# Altium project SistemaMonitoreo.PrjPcb
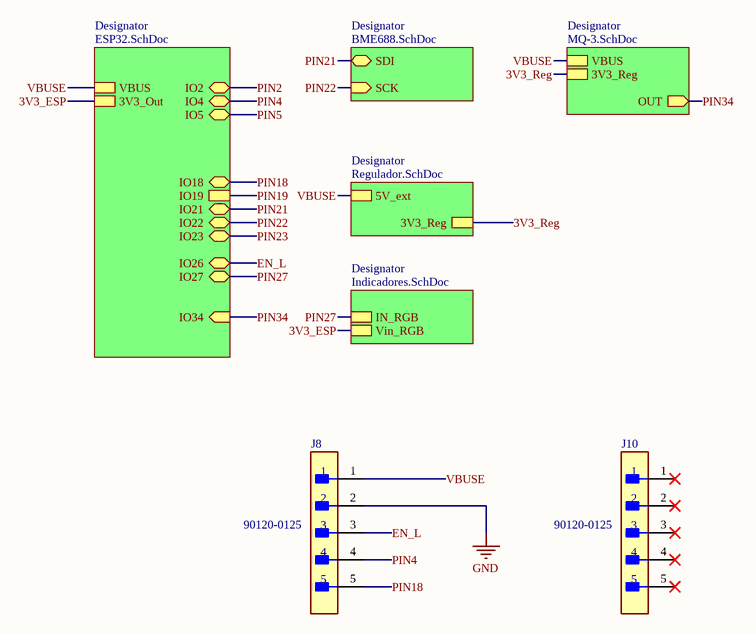
[diagram p0: Main.SchDoc]
6 sheets, 45 parts. Net scope: hierarchical (ports join the sheet entries above them; power ports are global).
Board file: SistemaMonitoreo.PcbDoc
Sheets:
  Main.SchDoc
    Designator = ESP32.SchDoc
    Designator = MQ-3.SchDoc
    Designator = Regulador.SchDoc
    Designator = BME688.SchDoc
    Designator = Indicadores.SchDoc

## Sheet Main.SchDoc
size A4; SheetNumber: 1; SheetTotal: 6

### Parts
J8  90120-0125  [FP-90120-0125-MFG]
J10  90120-0125  [FP-90120-0125-MFG]

### Sub-sheets
Designator = ESP32.SchDoc: IO18 (bidir), IO21 (bidir), IO22 (bidir), IO23 (bidir), IO27 (bidir), IO34 (in), VBUS, 3V3_Out, IO2 (bidir), IO4 (bidir), IO5 (bidir), IO19, IO26 (bidir)
Designator = MQ-3.SchDoc: OUT (out), 3V3_Reg, VBUS
Designator = Regulador.SchDoc: 3V3_Reg, 5V_ext
Designator = BME688.SchDoc: SDI (bidir), SCK (in)
Designator = Indicadores.SchDoc: IN_RGB, Vin_RGB

### Nets
3V3_ESP: sheet Designator/3V3_Out, sheet Designator/Vin_RGB  [project net 3V3]
GND: J8.2
VBUSE: J8.1 ; sheet Designator/VBUS, sheet Designator/VBUS, sheet Designator/5V_ext  [project net VBUS]
3V3_Reg: sheet Designator/3V3_Reg, sheet Designator/3V3_Reg
EN_L: J8.3 ; sheet Designator/IO26
PIN4: J8.4 ; sheet Designator/IO4  [project net IO4]
PIN18: J8.5 ; sheet Designator/IO18  [project net IO18]
PIN21: sheet Designator/IO21, sheet Designator/SDI  [project net IO21]
PIN22: sheet Designator/IO22, sheet Designator/SCK  [project net IO22]
PIN27: sheet Designator/IO27, sheet Designator/IN_RGB  [project net IO27]
PIN34: sheet Designator/IO34, sheet Designator/OUT  [project net IO34]

Not connected (* = marked no-connect by the designer): J10 1* 2* 3* 4* 5*

### Library data of the parts
J8 J10 = CMP-00257-00655425-1: 90120-0125 2.54mm Pitch C-Grid III Header, Single Row, Vertical, 5 Circuits, Tin (Sn) Plating; NexarPartId: 655425; Manufacturer Lifecycle Status: ACTIVE; Lead Length: 2.9mm; Number of Positions: 5; Current Rating: 3A; Mating Post Length: 6.75mm; Glow Wire Compliant: Non-compliant; Contact Resistance: 20mΩ; Voltage Rating: 350V; Gender: Male; Max Voltage Rating (DC): 350.35kV; Max Operating Temperature: 125°C; Number of Pins: 5; Plating: Tin; Contact Material: Brass; Mount: Through Hole; Contact Gender: Male; Packaging: Bulk; Schedule B: 8536694040; Lifecycle Status: Production; Lead Pitch: 2.54mm; Radiation Hardening: No; Orientation: Vertical; Min Operating Temperature: -55°C; Country of Origin: SK; Housing Color: Black; REACH SVHC: No SVHC; Contact Plating: Tin; Number of Rows: 1; Number of Circuits: 5; Termination: Solder; Number of Contacts: 5; Pitch: 2.54mm; Housing Material: Polyester; RoHS: Compliant; Lead Free: Lead Free; Voltage Rating (AC): 350V

## Sheet ESP32.SchDoc
size A4; SheetNumber: 2; SheetTotal: 6
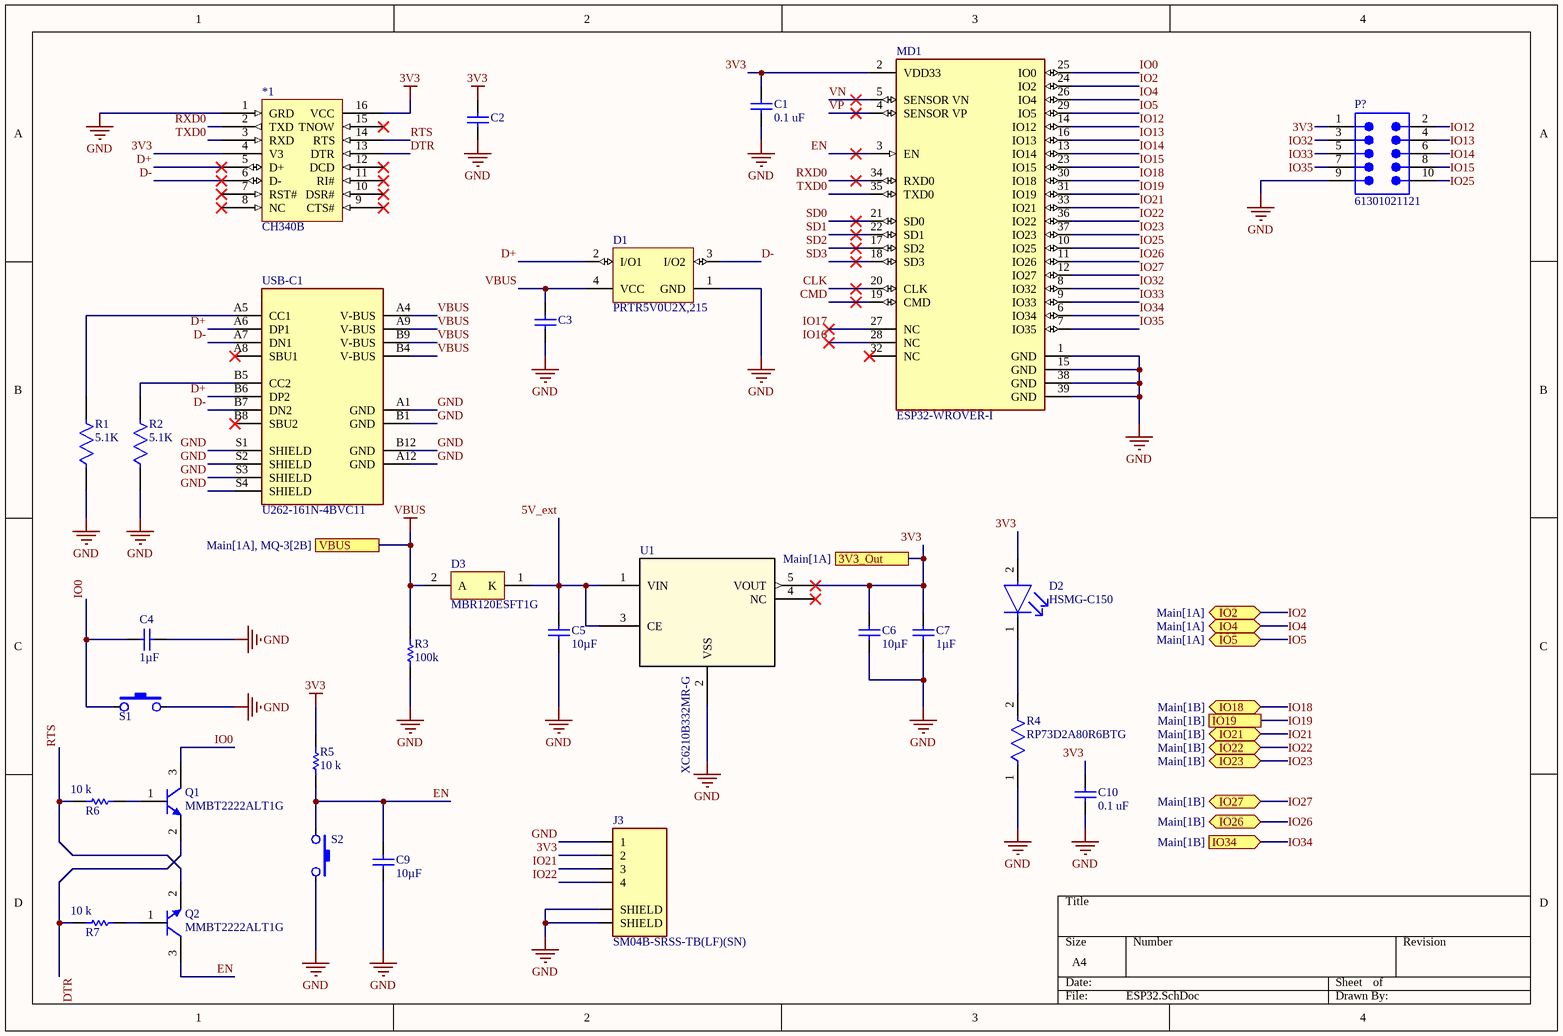
[diagram p1: ESP32.SchDoc]

### Parts
*1  CH340B  [CH340B]
C1  0.1 uF  [CAPC2013X94X50ML20T25]
C2  08055C104KAT2A  [CAPC2013X94X50ML20T25]  (value not drawn)
C3  08055C104KAT2A  [CAPC2013X94X50ML20T25]  (value not drawn)
C4  1µF  [CAPC2013X145X50ML20T25]
C5  10µF  [CAPC2013X140X50ML20T25]
C6  10µF  [CAPC2013X140X50ML20T25]
C7  1µF  [CAPC2013X145X50ML20T25]
C9  10µF  [CAPC2013X145X50ML20T25]
C10  0.1 uF  [CAPC2013X94X50ML20T25]
D1  PRTR5V0U2X,215  [NXP-SOT143B-4_V]
D2  HSMG-C150  [FP-HSMG-C150-MFG]
D3  MBR120ESFT1G  [ONSC-SOD-123FL-2-498_V]
J3  SM04B-SRSS-TB(LF)(SN)  [JST_SM04B-SRSS-TB(LF)(SN)]
MD1  ESP32-WROVER-I  [FP-ESP32-WROVER-I-MFG]
P?  61301021121  [61301021121]
Q1  MMBT2222ALT1G  [ONSC-SOT-23-3-318-08_V]
Q2  MMBT2222ALT1G  [ONSC-SOT-23-3-318-08_V]
R1  5.1K  [FP-CRCW0805-e3-MFG]
R2  5.1K  [FP-CRCW0805-e3-MFG]
R3  100k  [RESC2013X60X40ML20T25]
R4  RP73D2A80R6BTG  [FP-RP732A-MFG]
R5  10 k  [RESC2013X60X30ML20T20]
R6  10 k  [RESC2013X60X30ML20T20]
R7  10 k  [RESC2013X60X30ML20T20]
S1  IO0  [SMT_SW_PTS_820]  (value not drawn)
S2  PTS820J25MSMTRLFS  [SMT_SW_PTS_820]  (value not drawn)
U1  XC6210B332MR-G  [SOT-25_TOR-M]
USB-C1  U262-161N-4BVC11  [U262-161N-4BVC11]

### Ports
3V3_Out (see Main[1A]), IO2 (bidir, see Main[1A]), IO4 (bidir, see Main[1A]), IO5 (bidir, see Main[1A]), IO18 (bidir, see Main[1B]), IO19 (see Main[1B]), IO21 (bidir, see Main[1B]), IO22 (bidir, see Main[1B]), IO23 (bidir, see Main[1B]), IO26 (bidir, see Main[1B]), IO27 (bidir, see Main[1B]), IO34 (in, see Main[1B]), VBUS (see Main[1A], MQ-3[2B])

### Nets
3V3: *1.4(V3) *1.16(VCC) C1.2 C2.2 C6.2 C7.2 C10.2 D2.2(A) J3.2 MD1.2(VDD33) P?.1 R5.2 U1.5(VOUT) ; port 3V3_Out
GND: *1.1(GRD) C1.1 C2.1 C3.1 C4.1 C5.1 C6.1 C7.1 C9.1 C10.1 D1.1(GND) J3.1 J3.S1(SHIELD) J3.S2(SHIELD) MD1.1(GND) MD1.15(GND) MD1.38(GND) MD1.39(GND) P?.9 R1.1 R2.1 R3.1 R4.1 S1.2 S2.2 U1.2(VSS) USB-C1.A1(GND) USB-C1.A12(GND) USB-C1.B1(GND) USB-C1.B12(GND) USB-C1.S1(SHIELD) USB-C1.S2(SHIELD) USB-C1.S3(SHIELD) USB-C1.S4(SHIELD)
VBUS: C3.2 D1.4(VCC) D3.2(A) R3.2 USB-C1.A4(V-BUS) USB-C1.A9(V-BUS) USB-C1.B4(V-BUS) USB-C1.B9(V-BUS) ; port VBUS
5V_ext: C5.2 D3.1(K) U1.1(VIN) U1.3(CE)
CLK: MD1.20(CLK)
CMD: MD1.19(CMD)
D+: *1.5(D+) D1.2(I/O1) USB-C1.A6(DP1) USB-C1.B6(DP2)
D-: *1.6(D-) D1.3(I/O2) USB-C1.A7(DN1) USB-C1.B7(DN2)
DTR: *1.13(DTR) Q1.2(E) R7.2
EN: C9.2 MD1.3(EN) Q2.3(C) R5.1 S2.1
IO0: C4.2 MD1.25(IO0) Q1.3(C) S1.1
IO2: MD1.24(IO2) ; port IO2
IO4: MD1.26(IO4) ; port IO4
IO5: MD1.29(IO5) ; port IO5
IO12: MD1.14(IO12) P?.2
IO13: MD1.16(IO13) P?.4
IO14: MD1.13(IO14) P?.6
IO15: MD1.23(IO15) P?.8
IO16: MD1.28(NC)
IO17: MD1.27(NC)
IO18: MD1.30(IO18) ; port IO18
IO19: MD1.31(IO19) ; port IO19
IO21: J3.3 MD1.33(IO21) ; port IO21
IO22: J3.4 MD1.36(IO22) ; port IO22
IO23: MD1.37(IO23) ; port IO23
IO25: MD1.10(IO25) P?.10
IO26: MD1.11(IO26) ; port IO26  [project net EN_L]
IO27: MD1.12(IO27) ; port IO27
IO32: MD1.8(IO32) P?.3
IO33: MD1.9(IO33) P?.5
IO34: MD1.6(IO34) ; port IO34
IO35: MD1.7(IO35) P?.7
RTS: *1.14(RTS) Q2.2(E) R6.2
RXD0: *1.2(TXD) MD1.34(RXD0)
SD0: MD1.21(SD0)
SD1: MD1.22(SD1)
SD2: MD1.17(SD2)
SD3: MD1.18(SD3)
TXD0: *1.3(RXD) MD1.35(TXD0)
VN: MD1.5(SENSOR_VN)
VP: MD1.4(SENSOR_VP)
NetD2_1: D2.1(C) R4.2
NetQ1_1: Q1.1(B) R6.1
NetQ2_1: Q2.1(B) R7.1
NetR1_2: R1.2 USB-C1.A5(CC1)
NetR2_2: R2.2 USB-C1.B5(CC2)

Not connected (* = marked no-connect by the designer): *1 7(RST#)* 8(NC)* 9(CTS#)* 10(DSR#)* 11(RI#)* 12(DCD)* 15(TNOW)*; MD1 32(NC)*; U1 4(NC)*; USB-C1 A8(SBU1)* B8(SBU2)*

### Library data of the parts
*1 = CH340B: - USB 2.0 Transceiver 2Mbps SOP-16_150mil USB ICs ROHS; ComponentLink1Description: Datasheet; ComponentLink1URL: https://www.mpja.com/download/35227cpdata.pdf
C1-C3 C10 = CMP-2000-05016-1: Chip Capacitor, Ceramic, 0.1 uF, 10%, 50 V, 0805, RoHS, Tape and Reel; Manufacturer: AVX; Rated Voltage: 50V; Capacitance: 100nF; Dielectric: X7R; Case Size/Dimension: 0805; Tolerance (%): ±10%; Datasheet URL: http://www.farnell.com/datasheets/319609.pdf; Datasheet Version: Sep-07; Manufacturer URL: http://www.avx.com/
C4 C7 C9 = CMP-2007-01082-1: 1µF ±10% 16V Ceramic Capacitor X7R 0805 (2012 Metric); Manufacturer: Kemet; Part Number: C0805C105K4RAC7800
C5 C6 = CMP-2007-03242-1: 10µF ±10% 16V Ceramic Capacitor X5R 0805 (2012 Metric); Part Number: CL21A106KOQNNNG
D1 = CMP-2000-05285-1: Ultra Low Capacitance Double Rail-to-Rail ESD Protection Diode, 5.5 V, 1 pF, -40 to 85 degC, 4-Pin SOT143B, RoHS, Tape and Reel; Manufacturer: NXP Semiconductors; Capacitance Value: 16pF; Number of Elements: 1; Rad Hardened: No; Reverse Breakdown Voltage: 6V; Working Voltage (Max): 5.5V; Polarity: Uni-Directional; Configuration: Quad; Leakage Current: 0.1uA; Product Height (mm): 1mm; Suppressor Type: DiodeArrays; Product Length (mm): 3mm; Product Depth (mm): 1.4mm; ESD Protection Voltage: 8KV@ContactDisc; Package Type: SOT; Mounting: SurfaceMount; Packaging: TapeandReel; Datasheet Version: Rev. 02, 01/2008; Reverse Stand-off Voltage: 5.5V; Manufacturer URL: http://www.nxp.com/; Operating Temp Range: -40Cto85C; Operating Temperature Classification: Industrial; Working Voltage: 5.5V; Operating Temperature Min Deg. C: -40C; Datasheet URL: https://datasheet.ciiva.com/4479/prtr5v0u2x-102853-4479461.pdf; Leakage Current (Max): 0.1uA; Direction Type: Uni-Directional; Pin Count: 3+Tab; Operating Temperature Max Deg. C: 85C; Mounting Style: SurfaceMount; Package / Case: SOT
D2 = CMP-2000-05061-2: LED GREEN DIFFUSED 1206 SMD; Manufacturer: Broadcom; Led Orientation: Top View; Max Junction Temp: +95°C; Peak Emmision Wavelength: 570nm; Viewing Angle: 170°; Wavelength: 572nm; Reverse Voltage: 5V; Luminous Intensity: 15mcd; Forward Voltage: 2.2V; Power Dissipation: 65mW; Forward Current: 20mA; ComponentLink2Description: Datasheet; Lead Free: Yes; Temperature Range Low: -40°C; Package: HSMG-C150; Digikey Description: LED GREEN DIFFUSED 1206 SMD; Mouser Description: LED Uni-Color Green 570nm 2-Pin Chip LED T/R; Manufacturer Part Number: HSMG-C150; Temperature Range High: +85°C; Device Class L1: Optoelectronics; Colour: Green; Category: Diode; Device Class L3: unset; RoHS: TRUE; Height: 1.2mm; ComponentLink2URL: https://docs.broadcom.com/docs/AV02-0551EN; Device Class L2: LEDs; Automotive: No; Ipc Land Pattern Name: DIOCP320160X55; Octopart: https://octopart.com/hsmg-c150-broadcom-71131304; Temperature: -40°C to +85°C
D3 = CMP-1055-00434-1: Schottky Power Rectifier, 2-Pin SOD-123, Pb-Free, Tape and Reel; Manufacturer: On Semiconductor; Configuration: Single; IFSM Max (A): 40; ComponentLink2URL: http://www.onsemi.cn/pub_link/Collateral/MBR120ESFT1-D.PDF; PackageDescription: 2-Pin SOD, Body 1.65 x 2.7 mm; RoHS: TRUE; ComponentLink1URL: http://www.onsemi.com/; PackageVersion: Rev. D, 05/2013; PartNumber: MBR120ESFT1G; PackageReference: SOD-123FL-2-498; ComponentLink2Description: Datasheet; ComponentLink1Description: Manufacturer URL; DatasheetVersion: Rev. 4; ComponentLink3Description: Package Specification; ComponentLink3URL: http://www.onsemi.com/pub_link/Collateral/498-01.PDF; Mounting Technology: Surface Mount; Packing: Tape and Reel
J3 = SM04B-SRSS-TB(LF)(SN): Connector Header Surface Mount, Right Angle 4 position 0.039 _1.00mm_; MF: JST Sales; MP: SM04B-SRSS-TB_LF__SN_; Price: None; SnapEDA_Link: https://www.snapeda.com/parts/SM04B-SRSS-TB%28LF%29%28SN%29/JST%20Sales%20America%20Inc./view-part/557466/?ref=snap; Value: *; Availability: Unavailable; Package: None
MD1 = CMP-194065-000001-1: SMD MODULE, ESP32-D0WDQ6, 32MBIT; Manufacturer: Espressif; Number Of Adc Channels: 16; Min Supply Voltage: 2.3V; Interface: I2C,SPI,UART,I2S,Other; Max Frequency: 2484MHz; Nominal Supply Current: 500mA; Sensitivity: -98dBm; Max Supply Voltage: 3.6V; Number Of Gpio: 20; Data Rate: 150Mbits/s; Package: ESP32-WROVER-I; Temperature Range Low: -40°C; Temperature Range High: +85°C; Device Class L1: Integrated Circuits (ICs); Category: UNK; ComponentLink2Description: Datasheet; Device Class L2: RF Semiconductors and Devices; Automotive: No; Lead Free: Yes; Octopart: https://octopart.com/esp32-wrover-i-espressif+systems-89171349; ComponentLink2URL: https://www.espressif.com/sites/default/files/documentation/esp32-wrover_datasheet_en.pdf; Temperature: -40°C to +85°C; Height: 3.4mm; RoHS: TRUE; Digikey Description: SMD MODULE, ESP32-D0WDQ6, 32MBIT; Device Class L3: Transceivers; Manufacturer Part Number: ESP32-WROVER-I
P? = CMP-1502-01084-3: NexarPartId: 18818163; Connector Type: Male Pin; Insulation Resistance: 1GΩ; Row Spacing: 2.54mm; Insulation: Insulated; Number of Positions: 10; Current Rating: 3A; Voltage Rating: 250V; Gender: Male; Contact Resistance: 20mΩ; Contact Gender: Male; Number of Rows: 2; Min Operating Temperature: -40°C; Mount: Through Hole; Packaging: Bulk; Length: 12.7mm; Pitch: 2.54mm; RoHS: Compliant; Height: 2.54mm; Lead Pitch: 2.54mm; Number of Pins: 10; Housing Material: PBT; Orientation: Vertical; Flammability Rating: UL94 V-0; Termination: Through Hole; Width: 12.7mm; Color: Black; Contact Mating Length: 5.9944mm; Max Operating Temperature: 105°C; Operating Supply Voltage: 250V; Contact Material: Copper; Number of Contacts: 10; Contact Plating: Gold; REACH SVHC: Unknown
Q1 Q2 = CMP-1048-00538-1: General Purpose Transistor, NPN Silicon, 3-Pin SOT-23, Pb-Free, Tape and Reel; Manufacturer: On Semiconductor; fT Min (MHz): 300; IC Continuous (A): 0.6; ComponentLink3URL: http://www.onsemi.cn/pub_link/Collateral/318-08.PDF; PartNumber: MMBT2222ALT1G; RoHS: TRUE; ComponentLink1URL: http://www.onsemi.com/; ComponentLink3Description: Package Specification; ComponentLink2Description: Datasheet; Mounting Technology: Surface Mount; Packing: Tape and Reel; PackageDescription: 3-Pin Small Outline Transistor, Body 2.92 x 1.3 mm, Pitch 0.95 mm; DatasheetVersion: Rev. 10; PackageReference: SOT-23-3-318-08; ComponentLink2URL: http://www.onsemi.cn/pub_link/Collateral/MMBT2222LT1-D.PDF; Polarity: NPN; PackageVersion: Rev. AP, 11/2009; ComponentLink1Description: Manufacturer URL
R1 R2 = CMP-2001-04024-2: RES Thick Film, 5.1kΩ, 1%, 0.125W, 100ppm/°C, 0805; Power Rating: 125mW; Voltage Rating (DC): 150V; Resistance: 5.1kR; Packaging: Tape and Reel; Case Code (Metric): 2012; Contact Plating: Tin; Case Code (Imperial): 0805; Depth: 1.25mm; Tolerance: 1%; Width: 0.049inch; Temperature Coefficient: 100ppm/°C; Max Power Dissipation: 125mW; Military Standard: Not; Lead Free: Lead Free; Mount: Surface Mount; Min Operating Temperature: -55°C; Package Quantity: 10; Weight: 0.000194oz; Height: 0.45mm; Number of Terminations: 2; Max Operating Temperature: 155°C; Termination: SMD/SMT; Case/Package: 0805; Composition: Thick Film; Voltage Rating: 150V; Length: 2mm; Features: Automotive AEC-Q200; Radiation Hardening: No
R3 = CMP-2001-00583-1: 100 kOhms ±0.1% 0.125W, 1/8W Chip Resistor 0805 (2012 Metric) Automotive AEC-Q200 Thin Film; Part Number: ERA6AEB104V; Manufacturer: Panasonic
R4 = CMP-03211-002377-1: RESISTOR, 0805 80.6Ω, 0.1% 15ppm/°C; Manufacturer: TE Connectivity; Power Rating: 0.125W; Voltage Rating: 150V; ComponentLink2URL: https://www.te.com/commerce/DocumentDelivery/DDEController?Action=srchrtrv&DocNm=1773272&DocType=DS&DocLang=English; Device Class L3: Chip SMD Resistors; Automotive: No; ComponentLink2Description: Datasheet; Series: RP73; Temperature Coefficient: 15ppm/°C; Octopart: https://octopart.com/rp73d2a80r6btg-te+connectivity-42011633; octopart_url: https://octopart.com/rp73d2a80r6btg-te+connectivity-42011633; Device Class L2: Resistors; Device Class L1: Passive Components; Value: 80.6Ω; Composition: Thin Film; Lead Free: Yes; Ipc Land Pattern Name: RESC200125X55; Resistance: 80.6Ω; Package: RP732A; packaging: 250 cut tape length; Height: 0.65mm; Tolerance: 0.1%; Manufacturer Part Number: RP73D2A80R6BTG; Temperature: -55°C to 155°C; Temperature Range High: 155°C; RoHS: TRUE; Category: Res; Temperature Range Low: -55°C
R5-R7 = CMP-2001-04657-1: 10 kOhms ±5% 0.25W, 1/4W Chip Resistor 0805 (2012 Metric) Automotive AEC-Q200, Moisture Resistant Thick Film; Part Number: RK73B2ATTD103J; Manufacturer: KOA Speer
S1 = PTS820J25MSMTRLFS
U1 = XC6210B332MR-G: No Description Available; Mfr_Name: Torex Semiconductor; Copyright: Copyright (C) 2022 Ultra Librarian. All rights reserved.; Manufacturer_Part_Number: XC6210B332MR-G; RefDes: RefDes; Type: DEV
USB-C1 = U262-161N-4BVC11: USB - Type C Female 16 SMT USB Connectors RoHS; ComponentLink1Description: datasheet; ComponentLink1URL: https://datasheet.lcsc.com/szlcsc/2002271811_XKB-Connectivity-U262-161N-4BVC11_C319148.pdf; ComponentLink2Description: LCSC Link; ComponentLink2URL: https://lcsc.com/product-detail/USB-Connectors_XKB-Connectivity-U262-161N-4BVC11_C319148.html

## Sheet MQ-3.SchDoc
size A4; SheetNumber: 4; SheetTotal: 6
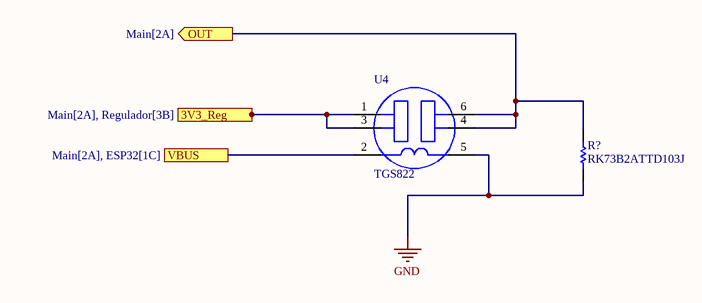
[diagram p2: MQ-3.SchDoc]

### Parts
R?  RK73B2ATTD103J  [RESC2013X60X30NL20T20]
U4  TGS822  [FP-TGS822-MFG]

### Ports
3V3_Reg (see Main[2A], Regulador[3B]), OUT (out, see Main[2A]), VBUS (see Main[2A], ESP32[1C])

### Nets
GND: R?.1 U4.5(GND)
VBUS: U4.2(VH) ; port VBUS
3V3_Reg: U4.1(VC) U4.3(VC) ; port 3V3_Reg
IO34: R?.2 U4.4(VRL) U4.6(VRL) ; port OUT

### Library data of the parts
R? = CMP-2001-04657-1: RL; Manufacturer: KOA Speer; Part Number: RK73B2ATTD103J
U4 = CMP-04312-24208239-1: TGS822 MOS-Type organic solvent vapors sensor; range: 50-5000ppm C2H5OH; supply: 5V; power: 660mW; Max Supply Voltage: 24V; NexarPartId: 24208239; Height: 10mm; RoHS: Compliant; Case/Package: Radial

## Sheet Regulador.SchDoc
size A4; SheetNumber: 5; SheetTotal: 6
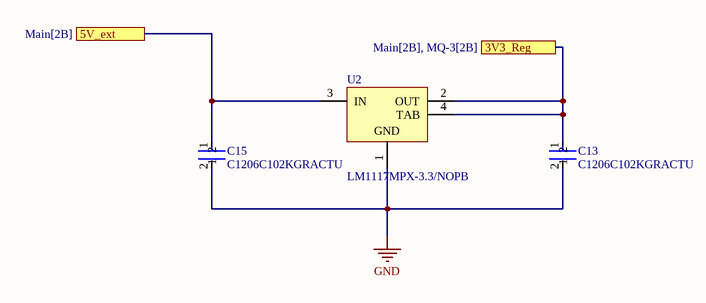
[diagram p3: Regulador.SchDoc]

### Parts
C13  C1206C102KGRACTU  [FP-C1206C-EF-IPC_A]
C15  C1206C102KGRACTU  [FP-C1206C-EF-IPC_A]
U2  LM1117MPX-3.3/NOPB  [DCY0004A_L]

### Ports
3V3_Reg (see Main[2B], MQ-3[2B]), 5V_ext (see Main[2B])

### Nets
GND: C13.2 C15.2 U2.1(GND)
VBUS: C15.1 U2.3(IN) ; port 5V_ext
3V3_Reg: C13.1 U2.2(OUT) U2.4(TAB) ; port 3V3_Reg

### Library data of the parts
C13 C15 = CMP-03020-034681-1: CAP CER 1000PF 2KV X7R 1206; Tolerance: 10%; Capacitance: 1nF; Dissipation Factor: 2.5%; Dielectric Material: Ceramic; Voltage Rating (DC): 2.5kV; Voltage: 2kV; REACH SVHC: No SVHC; Height: 1.6mm; Construction: Flat; Case/Package: 1206; Series: C; Mount: Surface Mount; RoHS Compliant: Yes; Package Quantity: 1; Length: 3.2mm; Width: 0.063inch; Voltage Rating: 2kV; Min Operating Temperature: -55°C; Case Code (Metric): 3216; Termination: SMD/SMT; Number of Pins: 2; Case Code (Imperial): 1206; Packaging: Tape and Reel; Dielectric: X7R; Thickness: 0.069inch; Depth: 1.6mm; Radiation Hardening: No; Max Operating Temperature: 125°C
U2 = CMP-0062-01639-4: 800mA Low-Dropout Linear Regulator, 4-pin SOT-223, Pb-Free; Manufacturer: Texas Instruments; High-Reliability: Y; PowerWise: N; PackageTopMarking: XYTT*N05A; CompType: LDO IC; ComponentLink1URL: http://www.ti.com/general/docs/lit/getliterature.tsp?genericPartNumber=LM1117-N&fileType=pdf; PartNumber: LM1117MPX-3.3/NOPB; ComponentLink1Description: Datasheet URL; PinCount: 4; Code_JEDEC: TO-261-AA; PackageDescription: Molded SOT-223, 6.50 x 3.56 x 1.6mm Body, 4 Lead, 2.3mm Pitch; PackageReference: DCY0004A; RoHS: Y; Code_IPC: SOT223-4

## Sheet BME688.SchDoc
size A4; SheetNumber: 3; SheetTotal: 6
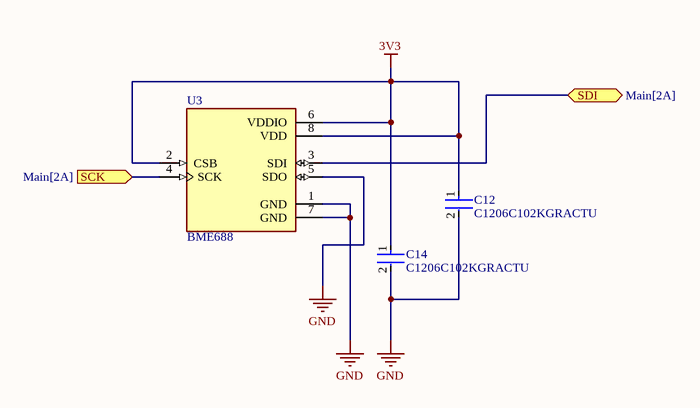
[diagram p4: BME688.SchDoc]

### Parts
C12  C1206C102KGRACTU  [FP-C1206C-EF-IPC_A]
C14  C1206C102KGRACTU  [FP-C1206C-EF-IPC_A]
U3  BME688  [BME680]

### Ports
SCK (in, see Main[2A]), SDI (bidir, see Main[2A])

### Nets
3V3: C12.1 C14.1 U3.2(CSB) U3.6(VDDIO) U3.8(VDD)
GND: C12.2 C14.2 U3.1(GND) U3.5(SDO) U3.7(GND)
IO21: U3.3(SDI) ; port SDI
IO22: U3.4(SCK) ; port SCK

### Library data of the parts
C12 C14 = CMP-03020-034681-1: as C13 on sheet Regulador; Voltage: 2kV; REACH SVHC: No SVHC; Height: 1.6mm; Construction: Flat; Case/Package: 1206; Series: C; Mount: Surface Mount; RoHS Compliant: Yes; Package Quantity: 1; Length: 3.2mm; Width: 0.063inch; Voltage Rating: 2kV; Min Operating Temperature: -55°C; Case Code (Metric): 3216; Termination: SMD/SMT; Number of Pins: 2; Case Code (Imperial): 1206; Packaging: Tape and Reel; Dielectric: X7R; Thickness: 0.069inch; Depth: 1.6mm; Radiation Hardening: No; Max Operating Temperature: 125°C
U3 = BME688: Gas sensor measuring relative humidity, barometric pressure, ambient temperature and gas (VOC); Package: None; MP: BME688; Price: None; Availability: Unavailable; Value: *

## Sheet Indicadores.SchDoc
size A4; SheetNumber: 6; SheetTotal: 6
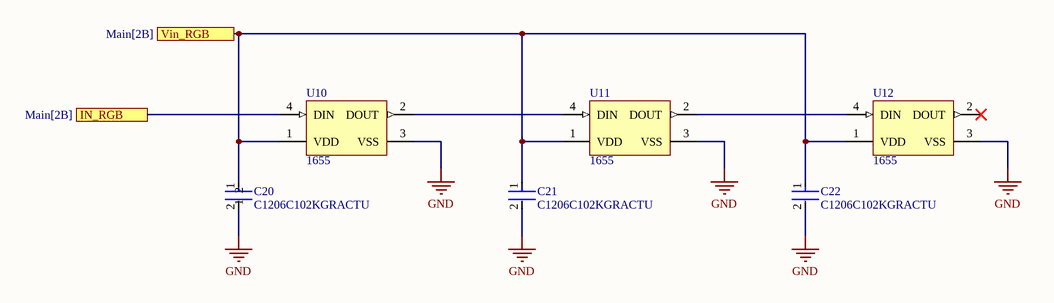
[diagram p5: Indicadores.SchDoc]

### Parts
C20  C1206C102KGRACTU  [FP-C1206C-EF-IPC_A]
C21  C1206C102KGRACTU  [FP-C1206C-EF-IPC_A]
C22  C1206C102KGRACTU  [FP-C1206C-EF-IPC_A]
U10  1655  [ADA-RGB-1655_V]
U11  1655  [ADA-RGB-1655_V]
U12  1655  [ADA-RGB-1655_V]

### Ports
IN_RGB (see Main[2B]), Vin_RGB (see Main[2B])

### Nets
3V3: C20.1 C21.1 C22.1 U10.1(VDD) U11.1(VDD) U12.1(VDD) ; port Vin_RGB
GND: C20.2 C21.2 C22.2 U10.3(VSS) U11.3(VSS) U12.3(VSS)
IO27: U10.4(DIN) ; port IN_RGB
NetU10_2: U10.2(DOUT) U11.4(DIN)
NetU11_2: U11.2(DOUT) U12.4(DIN)

Not connected (* = marked no-connect by the designer): U12 2(DOUT)*

### Library data of the parts
C20-C22 = CMP-03020-034681-1: as C13 on sheet Regulador; Voltage: 2kV; REACH SVHC: No SVHC; Height: 1.6mm; Construction: Flat; Case/Package: 1206; Series: C; Mount: Surface Mount; RoHS Compliant: Yes; Package Quantity: 1; Length: 3.2mm; Width: 0.063inch; Voltage Rating: 2kV; Min Operating Temperature: -55°C; Case Code (Metric): 3216; Termination: SMD/SMT; Number of Pins: 2; Case Code (Imperial): 1206; Packaging: Tape and Reel; Dielectric: X7R; Thickness: 0.069inch; Depth: 1.6mm; Radiation Hardening: No; Max Operating Temperature: 125°C
U10-U12 = CMP-2000-05026-1: Intelligent Control LED Integrated Light Source, 3.5 to 5.3 V, -25 to 80 degC, 4-Pin SMD, RoHS, Tape and Reel; Manufacturer: Adafruit-Industries-LLC; Number of LEDs: 10; Configuration: Discrete; Utilized LED: WS2812(5050); Datasheet URL: http://datasheet.octopart.com/ADA1655-Adafruit-Industries-datasheet-32028139.pdf; Series: Neopixel; Interface: -; Package Description: 4-Pin Surface Mount Device, Body 5 x 5 mm; Color: Red,Green,Blue(RGB); Category: Optoelectronics; Controller Type: -; Package Reference: 1655; Manufacturer URL: https://www.adafruit.com/; Mounting Type: SurfaceMount; Datasheet Version: May-13; Size / Dimension: 5.00mmLx5.00mmW; Family: Addressable,Specialty

## Nets that join several sheets
3V3: ESP32 (13 pins), BME688 (5 pins), Indicadores (6 pins)
GND: Main (J8.2), ESP32 (34 pins), MQ-3 (R?.1 U4.5), Regulador (C13.2 C15.2 U2.1), BME688 (5 pins), Indicadores (6 pins)
VBUS: Main (J8.1), ESP32 (8 pins), MQ-3 (U4.2), Regulador (C15.1 U2.3)
3V3_Reg: MQ-3 (U4.1 U4.3), Regulador (C13.1 U2.2 U2.4)
EN_L: Main (J8.3), ESP32 (MD1.11)
IO4: Main (J8.4), ESP32 (MD1.26)
IO18: Main (J8.5), ESP32 (MD1.30)
IO21: ESP32 (J3.3 MD1.33), BME688 (U3.3)
IO22: ESP32 (J3.4 MD1.36), BME688 (U3.4)
IO27: ESP32 (MD1.12), Indicadores (U10.4)
IO34: ESP32 (MD1.6), MQ-3 (R?.2 U4.4 U4.6)